# Altium schematic sheet TRV1.0.SchDoc
size A4
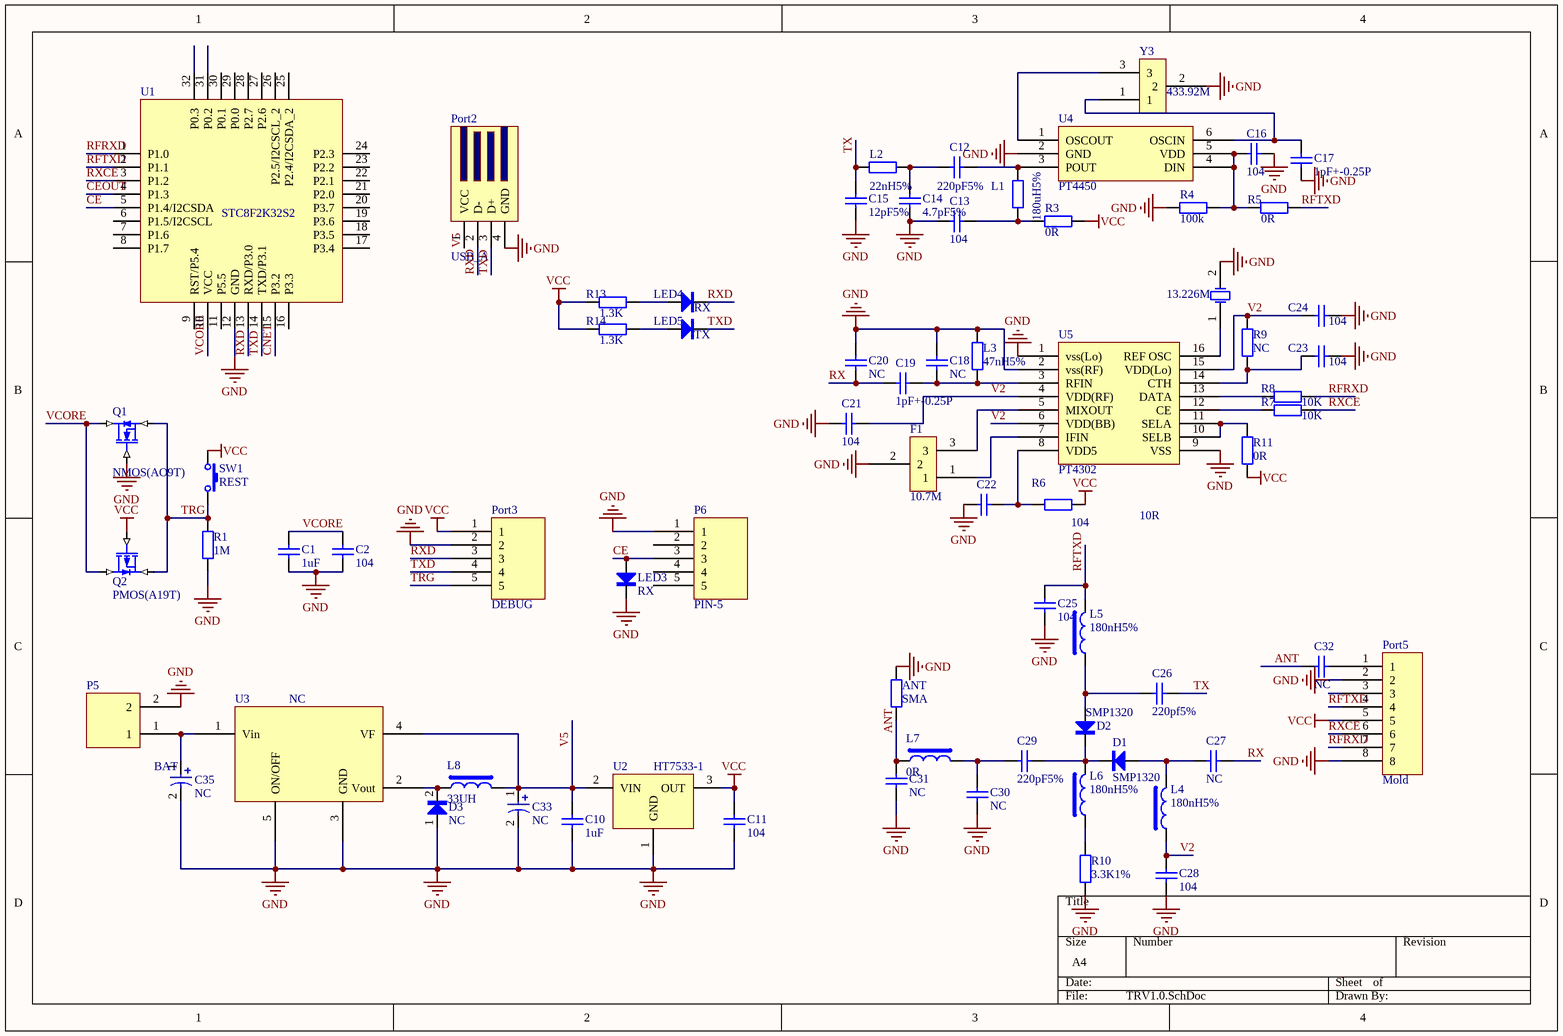
[diagram p0: TRV1.0.SchDoc]

## Parts
ANT  SMA  [SWA-KE天线母座]
C1  1uF  [0603]
C2  104  [0603]
C10  1uF  [0603]
C11  104  [0603]
C12  220pF5%  [0603]
C13  104  [0603]
C14  4.7pF5%  [0603]
C15  12pF5%  [0603]
C16  104  [0603]
C17  1pF+-0.25P  [0603]
C18  NC  [0603]
C19  1pF+-0.25P  [0603]
C20  NC  [0603]
C21  104  [0603]
C22  104  [0603]
C23  104  [0603]
C24  104  [0603]
C25  104  [0603]
C26  220pf5%  [0603]
C27  NC  [0603]
C28  104  [0603]
C29  220pF5%  [0603]
C30  NC  [0603]
C31  NC  [0603]
C32  NC  [0603]
C33  NC  [CAP6*12]
C35  NC  [CAP6*12]
D1  SMP1320  [0603]
D2  SMP1320  [0603]
D3  NC  [SS34]
F1  10.7M  [PT4450 XTAL]
L1  180uH5%  [0603]
L2  22nH5%  [0603]
L3  47nH5%  [0603]
L4  180nH5%  [0603]
L5  180nH5%  [0603]
L6  180nH5%  [0603]
L7  0R  [0603]
L8  33UH  [CD75]
LED3  RX  [LED-0603]
LED4  RX  [LED-0603]
LED5  TX  [LED-0603]
P5  BAT  [DIP2-2.54]
P6  PIN-5  [PCBComponent_1]
Port2  USB_A  [USB-A]
Port3  DEBUG  [STC_DEBUG]
Port5  Mold  [Pin-8]
Q1  NMOS(AO9T)  [SOT-23]
Q2  PMOS(A19T)  [SOT-23]
R1  1M  [0603]
R3  0R  [0603]
R4  100k  [0603]
R5  0R  [0603]
R6  10R  [0603]
R7  10K  [0603]
R8  10K  [0603]
R9  NC  [0603]
R10  3.3K1%  [0603]
R11  0R  [0603]
R13  1.3K  [0603]
R14  1.3K  [0603]
SW1  REST  [SW-1]
U1  STC8F2K32S2  [LQPF-32]
U2  HT7533-1  [3A5A3D]
U3  NC  [TS5B_N]
U4  PT4450
U5  PT4302  [PT4302]
Y3  433.92M  [PT4450 XTAL]
Y4  13.226M  [PT4306 XTAL]

## Nets
GND: ANT.2 C1.1 C2.1 C10.2 C11.2 C13.1 C14.1 C15.1 C16.1 C17.2 C18.1 C20.2 C21.2 C22.2 C23.1 C24.1 C25.2 C28.1 C30.2 C31.2 C33.2 C35.2 D3.1 F1.2 L3.2 LED3.2 P5.2 P6.1 Port2.4(GND) Port3.2 Port5.2 Port5.8 Q1.1(G) R1.1 R4.2 R10.2 U1.12(GND) U2.1(GND) U3.3(GND) U3.5(ON/OFF) U4.2(GND) U5.1(vss(Lo)) U5.2(vss(RF)) U5.9(VSS) Y3.2 Y4.2(OSC2)
VCC: C11.1 Port3.1 Port5.5 Q2.1(G) R3.1 R6.1 R11.2 R13.2 R14.2 SW1.1 U2.3(OUT)
ANT: ANT.1 C31.1 C32.1 L7.1
CE: LED3.1 P6.3 U1.5(P1.4/I2CSDA)
CEOUT: U1.4(P1.3)
CNET: U1.15(P3.2)
RFRXD: Port5.7 R8.1 U1.1(P1.0)
RFTXD: C25.1 L5.2 Port5.4 R5.1 U1.2(P1.1)
RX: C19.1 C20.1 C27.2
RXCE: Port5.6 R7.1 U1.3(P1.2)
RXD: LED4.2 Port2.2(D-) Port3.3 U1.13(RXD/P3.0)
TRG: Port3.5 Q1.2(D) Q2.2(S) R1.2 SW1.2
TX: C15.2 C26.2 L2.1
TXD: LED5.2 Port2.3(D+) Port3.4 U1.14(TXD/P3.1)
V2: C21.1 C24.2 C28.2 L4.1 R9.1 U5.4(VDD(RF)) U5.6(VDD(BB)) U5.15(VDD(Lo))
V5: C10.1 C33.1 L8.2 Port2.1(VCC) U2.2(VIN) U3.4(VF)
VCORE: C1.2 C2.2 Q1.3(S) Q2.3(D) U1.10(VCC)
NetC12_1: C12.1 C14.2 L2.2
NetC12_2: C12.2 L1.1 U4.3(POUT)
NetC13_2: C13.2 L1.2 R3.2
NetC16_2: C16.2 R4.1 R5.2 U4.4(DIN) U4.5(VDD)
NetC17_1: C17.1 U4.6(OSCIN) Y3.1
NetC18_2: C18.2 C19.2 L3.1 U5.3(RFIN)
NetC22_1: C22.1 R6.2 U5.8(VDD5)
NetC23_2: C23.2 R9.2 U5.14(CTH)
NetC26_1: C26.1 D2.1 L5.1
NetC27_1: C27.1 D1.1 L4.2
NetC29_1: C29.1 D1.2 D2.2 L6.2
NetC29_2: C29.2 C30.1 L7.2
NetC32_2: C32.2 Port5.1
NetC35_1: C35.1 P5.1 U3.1(Vin)
NetD3_2: D3.2 L8.1 U3.2(Vout)
NetF1_1: F1.1 U5.7(IFIN)
NetF1_3: F1.3 U5.5(MIXOUT)
NetL6_1: L6.1 R10.1
NetLED4_1: LED4.1 R13.1
NetLED5_1: LED5.1 R14.1
NetR7_2: R7.2 U5.12(CE)
NetR8_2: R8.2 U5.13(DATA)
NetR11_1: R11.1 U5.10(SELB) U5.11(SELA)
NetU4_1: U4.1(OSCOUT) Y3.3
NetU5_16: U5.16(REF_OSC) Y4.1(OSC1)

Not connected (* = marked no-connect by the designer): P6 2 4 5; Port5 3; U1 6(P1.5/I2CSCL) 7(P1.6) 8(P1.7) 9(RST/P5.4) 11(P5.5) 16(P3.3) 17(P3.4) 18(P3.5) 19(P3.6) 20(P3.7) 21(P2.0) 22(P2.1) 23(P2.2) 24(P2.3) 25(P2.4/I2CSDA_2) 26(P2.5/I2CSCL_2) 27(P2.6) 28(P2.7) 29(P0.0) 30(P0.1) 31(P0.2) 32(P0.3)

## Library data of the parts
ANT L1-L3 R1 R3-R11 R13 R14 = Res2: Resistor; Published: 8-Jun-2000; LatestRevisionDate: 17-Jul-2002; LatestRevisionNote: Re-released for DXP Platform.; PackageReference: AXIAL-0.4; Publisher: Altium Limited
C1 C2 C10-C32 = Cap: Capacitor; Published: 8-Jun-2000; LatestRevisionDate: 17-Jul-2002; LatestRevisionNote: Re-released for DXP Platform.; PackageReference: RAD-0.3; Publisher: Altium Limited
C33 C35 = CAP2
D1-D3 LED3-LED5 = DIODE
F1 = Filter
L4-L8 = L: Inductor
Port2 = USB
Port3 = PIN-5
Port5 = Pin-8
Q1 = MOSFET-N: mosfet
Q2 = MOSFET-P: mosfet
SW1 = SW-P: key
U1 = STC8F2K64S2
U3 = LM2596
Y3 = PT4450-XTAL
Y4 = XTAL: Crystal Oscillator